# EAGLE design PE01 (EAGLE 6.3)
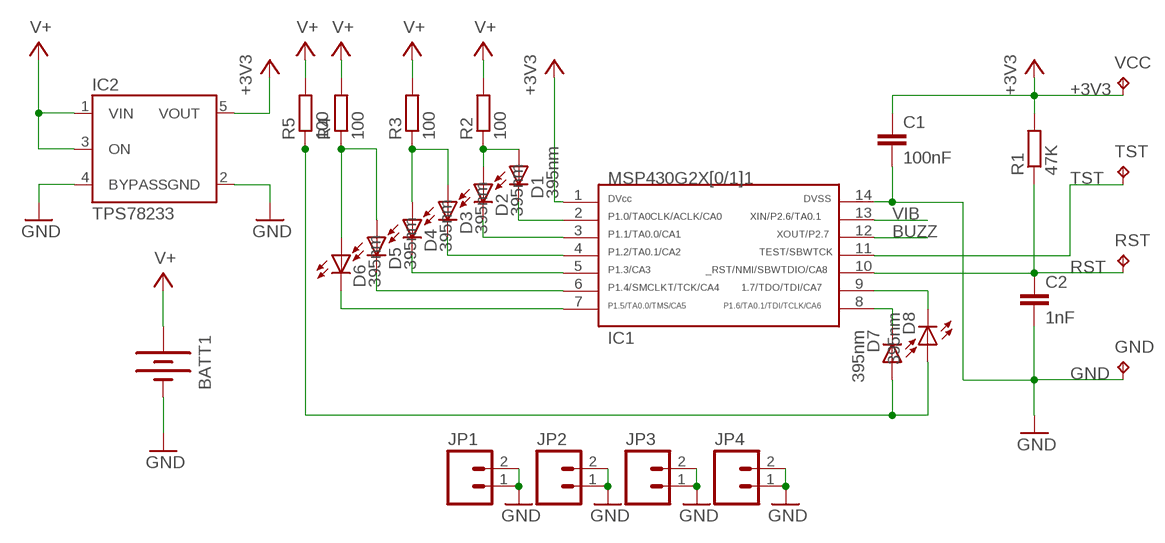
[diagram p0: schematic, sheet 1]

## Parts
BATT1  BATTERY20MM_4LEGS  [BATTCON_20MM_4LEGS]
C1  100nF  CAP0805  [0805]
C2  1nF  CAP0805  [0805]
D1  395nm  LED-0805  [LED-805]
D2  395nm  LED-0805  [LED-805]
D3  395nm  LED-0805  [LED-805]
D4  395nm  LED-0805  [LED-805]
D5  395nm  LED-0805  [LED-805]
D6  395nm  LED-0805  [LED-805]
D7  395nm  LED-0805  [LED-805]
D8  395nm  LED-0805  [LED-805]
GND  TPTP10R  [TP10R]
IC1  MSP430G2231  G2X[0/1]1---PW14  [PW14]
IC2  TPS78233  LP2982M5  [SOT23-5]
JP1  M021X02_NO_SILK  [1X02_NO_SILK]
JP2  M021X02_NO_SILK  [1X02_NO_SILK]
JP3  M021X02_NO_SILK  [1X02_NO_SILK]
JP4  M021X02_NO_SILK  [1X02_NO_SILK]
R1  47K  R-EU_R0603  [R0603]
R2  100  R-EU_R0603  [R0603]
R3  100  R-EU_R0603  [R0603]
R4  100  R-EU_R0603  [R0603]
R5  100  R-EU_R0603  [R0603]
RST  TPTP10R  [TP10R]
TST  TPTP10R  [TP10R]
VCC  TPTP10R  [TP10R]

## Nets
+3V3: C1.1 IC1.1 IC2.5(VOUT) R1.2 VCC.TP
BUZZ: IC1.12
GND: BATT1.2(-) C1.2 C2.2 GND.TP IC1.14 IC2.2(GND) IC2.4(BYPASS) JP1.1 JP1.2 JP2.1 JP2.2 JP3.1 JP3.2 JP4.1 JP4.2
N$1: D6.C IC1.7
N$2: D5.C IC1.6
N$3: D8.C IC1.9
N$4: D7.C IC1.8
N$5: D4.C IC1.5
N$6: D3.C IC1.4
N$7: D2.C IC1.3
N$8: D1.C IC1.2
N$10: D7.A D8.A R5.1
N$20: D3.A D4.A R3.1
N$21: D5.A D6.A R4.1
N$23: D1.A D2.A R2.1
RST: C2.1 IC1.10 R1.1 RST.TP
TST: IC1.11 TST.TP
V+: BATT1.1(+) IC2.1(VIN) IC2.3(ON) R2.2 R3.2 R4.2 R5.2
VIB: IC1.13

## Library data of the parts
BATT1 = SparkFun:BATTERY: Battery Holders Various common sizes : AA, AAA, 20mm coin cell and 12mm coin cell.
C1 C2 = SparkFun:CAP: Capacitor Standard 0603 ceramic capacitor, and 0.1" leaded capacitor.
D1-D8 = dp_devices:LED: Light Emitting Diode
GND RST TST VCC = testpad:TP: Test pad
IC1 = TI_MSP430_v16:G2X[0/1]1---PW14: MSP430G2X[0/1]1 MSP430G2001, MSP430G2101, MSP430G2201,MSP430G2111, G2211 TSSOP (PW) 14 Pin Package http://focus.ti.com/docs/prod/folders/print/msp430g2111.html
IC2 = v-reg-3:LP2982: National Semiconductor <http://www.national.com> Micropower Linear Regulator 50mA regulated output, Vin 16V max., ultra-low dropout of 120mV @ 50mA, 1µA standby current, low noise
JP1-JP4 = SparkFun:M02: Header 2 Standard 2-pin 0.1" header. Use with straight break away headers (SKU : PRT-00116), right angle break away headers (PRT-00553), swiss pins (PRT-00743), machine pins (PRT-00117), and female headers (PRT-00115). Molex polarized connector foot print use with SKU : PRT-08233 with associated crimp pins and housings.
R1-R5 = rcl:R-EU_: RESISTOR, European symbol

## Board
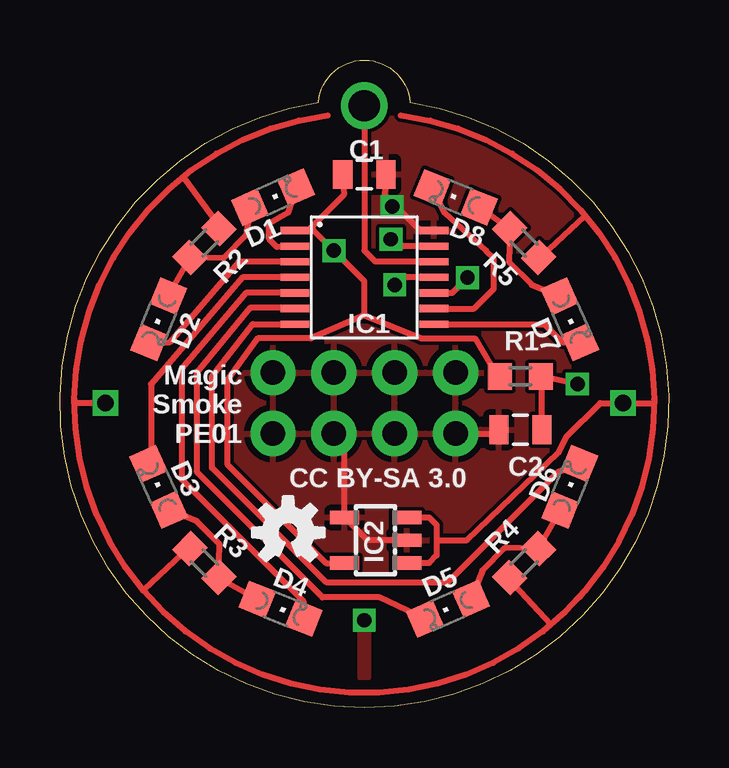
[diagram p1: board, top side]
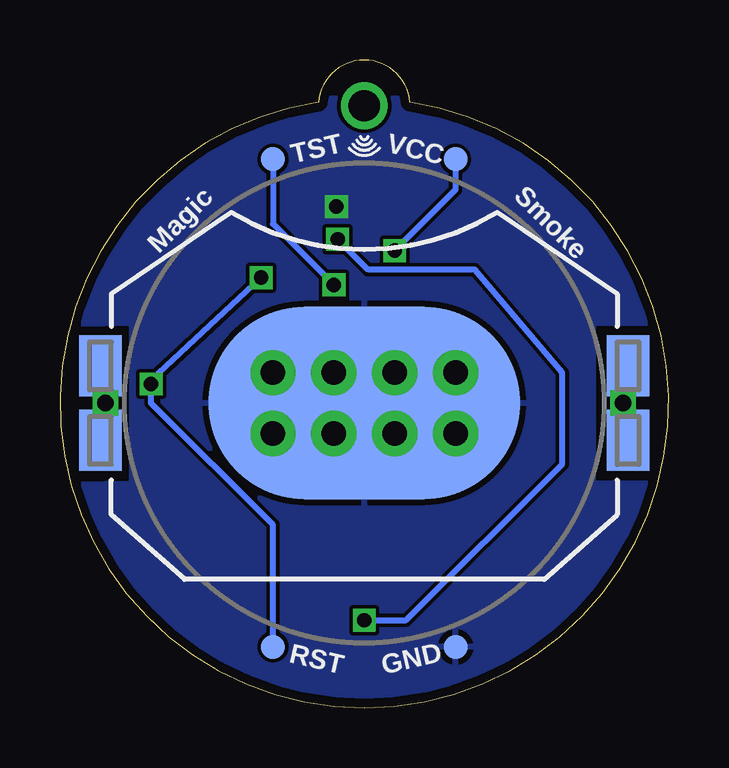
[diagram p2: board, bottom side, seen from below]

Size 25.38 x 26.99 mm. Coordinates in mm from the lower left corner, seen from the top.
Outline: 10.78,25.24 arc-170 14.59,25.24 arc-171 12.69,0 arc-171 10.78,25.24
Copper layers (1*16): Top 0.0356mm / dielectric 1.5011mm / Bottom 0.0356mm
Design rules "LaenPCBOrder *": minimum track width 6mil, minimum drill 13mil, track to track 6mil, track to pad 6mil, pad to pad 6mil, via to via 6mil, smd to smd 6mil, copper to edge 15mil, drill to drill 6mil, minimum pad ring 7mil, minimum via ring 7mil, stop-mask expansion 3mil, vias tented up to drill 24mil, thermal gap 10mil

### Footprints (pad centres in the part's own frame; a part is rotated, then mirrored left to right if it is on the bottom)
BATTCON_20MM_4LEGS = smd 1.778 x 2.54: 1 -11,1.55; 3 11,1.55; P$1 -11,-1.55; P$2 11,-1.55 | smd 13 x 8: 2 0,0
0805 = smd 0.8 x 1.2: 1 -0.9,0; 2 0.9,0
LED-805 = smd 1.2 x 1.2: A 0,-1.05; C 0,1.05
TP10R = smd 1 x 1: TP 0,0
PW14 = smd 0.3 x 1.2: 1 -1.95,-2.9; 2 -1.3,-2.9; 3 -0.65,-2.9; 4 0,-2.9; 5 0.65,-2.9; 6 1.3,-2.9; 7 1.95,-2.9; 8 1.95,2.9; 9 1.3,2.9; 10 0.65,2.9; 11 0,2.9; 12 -0.65,2.9; 13 -1.3,2.9; 14 -1.95,2.9
SOT23-5 = smd 0.55 x 1.2: 1 -0.95,-1.3; 2 0,-1.3; 3 0.95,-1.3; 4 0.95,1.3; 5 -0.95,1.3
1X02_NO_SILK = drill 1.016 pad 1.88: 1 0,0; 2 2.54,0
R0603 = smd 1 x 1.1: 1 -0.85,0; 2 0.85,0

### Placement (x,y rotation side)
BATT1  12.69,12.7 180 bottom
C1  12.69,22.23 0 top
C2  19.2,11.59 180 top
D1  8.88,21.27 293.7 top
D2  4.12,16.19 157.6 top
D3  4.12,9.21 24.1 top
D4  9.2,4.13 248 top
D5  16.18,4.13 113.7 top
D6  21.26,9.21 337.7 top
D7  21.26,16.19 204.1 top
D8  16.5,21.27 68 top
GND  8.88,2.54 210 bottom
IC1  12.69,17.94 270 top
IC2  13.16,6.98 90 top
JP1  8.88,11.43 90 top
JP2  11.42,11.43 90 top
JP3  13.96,11.43 90 top
JP4  16.5,11.43 90 top
R1  19.2,13.81 180 top
R2  6.02,19.37 45 top
R3  6.02,6.03 135 top
R4  19.36,6.03 225 top
R5  19.36,19.37 315 top
RST  16.5,2.54 150 bottom
TST  16.5,22.86 210 bottom
U$1  [OSHW-LOGO-S]  9.51,7.3 0 top
VCC  8.88,22.86 150 bottom

### Tracks (layer width: path | path; a pad name or v marks a point on that pad's centre or on a via)
+3V3  (via drill 0.6)
  Top 0.254: C1.1 11.84,21.38 10.35,19.89 IC1.1 10.58,19.89 v11.42,19.05 12.69,17.78 12.69,16.35 | 12.69,16.35 15.07,15.4 17.29,15.4 18.24,13.81 R1.2 | 12.69,16.35 10.47,15.4 8.24,15.4 6.97,13.65 6.97,10.16 11.1,6.03 IC2.5
  Bottom 0.254: VCC.TP 8.88,21.59 v11.42,19.05
BUZZ  (via drill 1.3)
  Top 0.254: v12.69,25.08 12.69,19.05 13.15,18.59 IC1.12
GND  (via drill 0.6)
  Top 0.254: IC2.2 12.81,6.98 IC2.4 11.86,10.98 JP2.1 | JP4.1 18.14,11.43 C2.2 | C1.2 13.54,21.38 15.02,19.89 IC1.14
  Bottom 0.254: JP1.2 JP2.2 JP3.2 | JP1.1 JP2.1 JP3.1 | JP3.1 JP4.1 | JP3.2 JP4.2 | BATT1.2 JP3.1 | JP3.2 JP3.1
  other vias: 13.85,20.88
  pour Bottom: -5.09,25.4 -5.09,16.03 3.16,16.03 3.16,9.37 -5.25,9.37 -5.09,0 30.47,0 30.47,9.21 22.37,9.37 22.37,16.03 30.47,15.88 30.47,25.4
  pour Top: -6.36,25.08 31.74,25.08 31.74,15.88 22.37,16.03 22.37,9.37 31.74,9.21 31.74,0 13.96,0 13.96,4.45 11.42,4.45 11.42,0 -6.36,0 -6.36,9.37 3.16,9.37 3.16,16.03 -6.36,16.03
N$1
  Top 0.254: IC1.7 8.04,15.99 6.34,13.81 6.34,10 11.1,5.24 16.18,5.24 20.78,9.84 D6.C
N$2
  Top 0.254: IC1.6 9.76,16.67 7.93,16.67 5.7,13.97 5.7,9.84 10.94,4.6 13.32,4.6 D5.C
N$3
  Top 0.254: IC1.9 17.26,16.64 18.09,17.46 18.09,18.73 17.77,19.05 16.02,20.64 D8.C
N$4
  Top 0.254: IC1.8 20.19,15.99 20.94,15.24 D7.C
N$5
  Top 0.254: IC1.5 7.75,17.29 5.07,14.13 5.07,9.52 10.15,4.45 10.15,3.76 D4.C
N$6
  Top 0.254: IC1.4 7.61,17.94 3.8,13.49 3.8,10.37 D3.C
N$7
  Top 0.254: D2.C 4.59,15.24 7.46,18.59 IC1.3
N$8
  Top 0.254: D1.C 9.51,20.64 8.72,20.16 8.72,19.53 9.04,19.21 IC1.2
N$10
  Top 0.254: D8.A R5.1 18.72,18.57 19.67,17.62 D7.A
N$20
  Top 0.254: D4.A R3.1 6.66,6.83 5.7,7.78 D3.A
N$21
  Top 0.254: D6.A R4.1 18.56,6.67 17.61,5.72 D5.A
N$23
  Top 0.254: D2.A R2.1 6.81,18.73 7.77,19.69 D1.A
RST  (via drill 0.6)
  Top 0.254: IC1.10 16.35,17.29 v16.99,17.92 | v21.58,13.49 R1.1 | 19.94,13.92 R1.1 | C2.1 20.1,13.76 R1.1
  Bottom 0.254: v16.99,17.92 21.58,13.65 v21.58,13.49 21.58,12.7 16.5,7.62 RST.TP
TST  (via drill 0.6)
  Top 0.254: IC1.11 14.28,17.94 v13.96,17.62
  Bottom 0.254: TST.TP 16.5,20.16 v13.96,17.62
V+  (via drill 0.7)
  Top 0.152: 14.21,24.69 16.02,24.29 17.13,23.97 19.04,23.02 20.94,21.59 21.9,20.48 23.01,19.05 23.96,17.15 24.28,16.03 24.75,13.97 24.75,12.7 24.75,11.75 24.59,10.64 24.12,8.73 23.48,7.3 22.69,5.87 21.74,4.6 20.47,3.49 | 11.16,24.69 9.2,24.29 7.61,23.65 6.66,23.18 5.7,22.54 5.15,22.12 4.43,21.59 3.16,20.16 2.37,19.05 1.73,17.78 1.1,16.19 0.62,13.97 0.62,12.7 0.62,11.59 0.94,9.84 1.58,7.94 2.53,6.19 3.48,4.92
  Top 0.254: 14.21,24.69 arc-346 11.16,24.69 | 14.75,6.04 IC2.1 15.39,6.03 15.7,6.35 15.7,6.98 | IC2.3 15.39,7.94 15.7,7.62 15.7,6.98 | 15.7,6.98 16.97,6.98 20.78,10.64 21.1,11.27 22.53,12.7 v23.48,12.7 24.75,12.7 | 5.15,22.12 6.81,19.84 R2.2 | 20.47,3.49 18.69,5.41 R4.2 | 5.42,6.68 5.4,6.7 | 19.96,18.7 19.83,18.57 | 19.83,18.57 R5.2 | 5.4,6.7 R3.2 | 5.4,6.7 3.48,4.92 | 19.83,18.57 21.9,20.48 | v1.89,12.7 0.62,12.7
  Bottom 0.254: 1.89,11.35 BATT1.1 1.69,11 | 1.69,11 1.89,10.8 | 1.69,11 v1.89,12.7
VIB  (via drill 0.6)
  Top 0.254: IC1.13 14.09,19.24 v13.8,19.53
  Bottom 0.254: v12.69,3.65 10.94,3.65 4.43,10.16 4.43,13.97 8.08,18.26 12.53,18.26 v13.8,19.53
  pour Top: 12.85,1.27 12.53,1.27 12.53,3.65 12.85,3.65

### Text on the board
tPlace: Magic / Smoke / PE01 | CC BY-SA 3.0
bPlace: Smoke | Magic